# EAGLE schematic test2 (EAGLE 9.5.0)
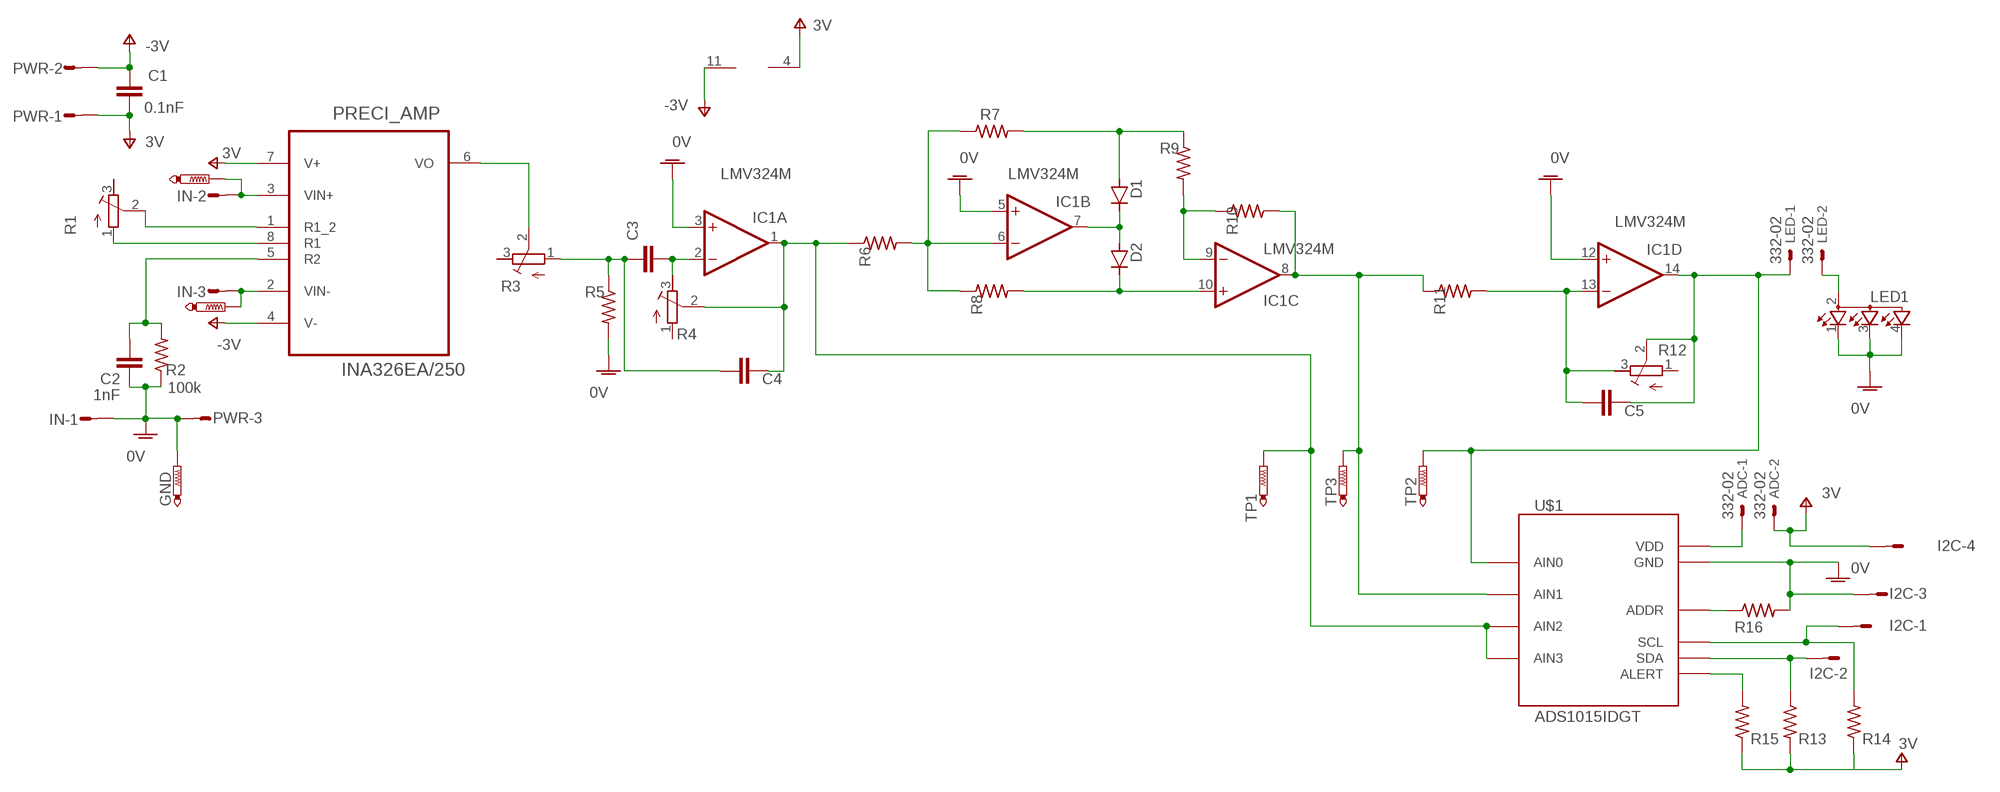
[diagram p0: schematic, sheet 1]

## Parts
ADC  332-02  [332-02]
C1  0.1nF  C-EUC0603  [C0603]
C2  1nF  C-EUC0603  [C0603]
C3  0.1nF  C-EUC0603  [C0603]
C4  0.1nF  C-EUC0603  [C0603]
C5  0.1nF  C-EUC0603  [C0603]
D1  D-SOD-80  [SOD80]
D2  D-SOD-80  [SOD80]
GND  PTR1PAD1-13  [P1-13]
I2C  MT6-4Y  [MT6-4Y]
IC1  LMV324M  [SO14]
IN  MT6-3  [MT6-3]
IN+  PTR1PAD1-13  [P1-13]
IN-  PTR1PAD1-13  [P1-13]
LED  332-02  [332-02]
LED1  TOPLED-3  [P-LCC-4-3]
PRECI_AMP  INA326EA/250  [SOP65P490X110-8N]
PWR  MT6-3  [MT6-3]
R1  R-TRIMM4G/J  [RTRIM4G/J]
R2  100k  R-US_R0603  [R0603]
R3  R-TRIMM4G/J  [RTRIM4G/J]
R4  R-TRIMM4G/J  [RTRIM4G/J]
R5  100k  R-US_R0603  [R0603]
R6  100k  R-US_R0603  [R0603]
R7  100k  R-US_R0603  [R0603]
R8  100k  R-US_R0603  [R0603]
R9  100k  R-US_R0603  [R0603]
R10  100k  R-US_R0603  [R0603]
R11  100k  R-US_R0603  [R0603]
R12  R-TRIMM4G/J  [RTRIM4G/J]
R13  100k  R-US_R0603  [R0603]
R14  100k  R-US_R0603  [R0603]
R15  100k  R-US_R0603  [R0603]
R16  100k  R-US_R0603  [R0603]
TP1  PTR1PAD1-13  [P1-13]
TP2  PTR1PAD1-13  [P1-13]
TP3  PTR1PAD1-13  [P1-13]
U$1  ADS1015IDGT  [MSOP10_0.5]

## Nets
GNDA: C2.1 GND.TP I2C.3 IC1.3(A:+IN) IC1.5(B:+IN) IC1.12(D:+IN) IN.1 LED1.1(CRED) LED1.3(CBLUE) LED1.4(CGREEN) PWR.3 R2.1 R5.2 R16.2 U$1.3(GND) ; supply symbol labelled 0V
N$1: PRECI_AMP.1(R1_2) R1.2(S)
N$2: PRECI_AMP.8(R1) R1.1(A)
N$3: IN+.TP IN.2 PRECI_AMP.3(VIN+)
N$4: C2.2 PRECI_AMP.5(R2) R2.2
N$5: IN-.TP IN.3 PRECI_AMP.2(VIN-)
N$6: C3.2 C4.2 R3.1(A) R5.1
N$7: C3.1 IC1.2(A:-IN) R4.3(E)
N$8: C4.1 IC1.1(A:OUT) R4.2(S) R6.1 TP1.TP U$1.6(AIN2) U$1.7(AIN3)
N$9: PRECI_AMP.6(VO) R3.2(S)
N$10: IC1.6(B:-IN) R6.2 R7.1 R8.1
N$11: D2.1(C) IC1.10(C:+IN) R8.2
N$12: IC1.9(C:-IN) R9.2 R10.1
N$13: D1.1(C) D2.2(A) IC1.7(B:OUT)
N$14: D1.2(A) R7.2 R9.1
N$15: IC1.8(C:OUT) R10.2 R11.1 TP3.TP U$1.5(AIN1)
N$16: C5.2 IC1.13(D:-IN) R11.2 R12.3(E)
N$17: I2C.2 R13.1 U$1.9(SDA)
N$18: R16.1 U$1.1(ADDR)
N$19: R15.2 U$1.2(ALERT)
N$20: LED1.2(A2) LED.2
N$21: I2C.1 R14.2 U$1.10(SCL)
N$22: C5.1 IC1.14(D:OUT) LED.1 R12.2(S) TP2.TP U$1.4(AIN0)
V+: ADC.2 C1.1 I2C.4 IC1.4(P:V+) PRECI_AMP.7(V+) PWR.1 R13.2 R14.1 R15.1 ; supply symbol labelled 3V
V-: C1.2 IC1.11(P:V-) PRECI_AMP.4(V-) PWR.2 ; supply symbol labelled -3V
VDD: ADC.1 U$1.8(VDD)
Unconnected: R1.3(E) R3.3(E) R4.1(A) R12.1(A)

## Library data of the parts
ADC LED = con-garry:332-02: 2 Pin - 2mm Dual Row Source: www.mpe-connector.de / garry_shortform_2012.pdf
C1-C5 = rcl:C-EU: CAPACITOR, European symbol; SPICEPREFIX: C
D1 D2 = semicon-smd-ipc:D-: DIODE unfilled
GND IN+ IN- TP1-TP3 = testpad:PTR1: TEST PIN
I2C = con-amp-mt:MT6-4Y: AMP MT6 CONNECTOR; OC_FARNELL: unknown; OC_NEWARK: unknown
IC1 = linear:LMV324?*: Quad General Purpose, Low Voltage, Rail-to-Rail Output Operational Amplifiers Source: http://www.national.com/mpf/LM/LMV321.html http://www.national.com/dt/lmv_qual.pdf; SPICEPREFIX: J
IN PWR = con-amp-mt6:MT6-3: AMP MT6 CONNECTOR; OC_FARNELL: unknown; OC_NEWARK: unknown
LED1 = led:TOPLED-3: OSRAM - Hyper Multi TOPLED® (RGB) LB E673, LV E673, LT E673 - Power TOPLED® Enhanced optical Power LED (HOP2000) LS E67B, LA E67B, LO E67B, LY E67B - Hyper Multi TOPLED® Enhanced optical Power LED (HOP2000 / ATON®) LATB T66B - Hyper Multi TOPLED® Hyper-Bright LED LATB T686 Source: http://www.osram.convergy.de/
PRECI_AMP = INA326EA_250:INA326EA/250: Precision, Rail-to-Rail I/O INSTRUMENTATION AMPLIFIER; DESCRIPTION: Precision, Low Drift, CMOS Instrumentation Amplifier 8-VSSOP -40 to 85; DIGI-KEY_PART_NUMBER: 296-15312-1-ND; DIGI-KEY_PURCHASE_URL: https://www.digikey.com/product-detail/en/texas-instruments/INA326EA-250/296-15312-1-ND/568254?utm_source=snapeda&utm_medium=aggregator&utm_campaign=symbol; MF: Texas Instruments; MP: INA326EA/250; PACKAGE: MSOP-8 Texas Instruments
R1 R3 R4 R12 = trimmer:R-TRIMM: Trimm resistor; SPICEMODEL: X; SPICEPREFIXL: POT
R2 R5-R11 R13-R16 = rcl:R-US_: RESISTOR, American symbol; SPICEPREFIX: R
U$1 = ADS1015:ADS1015: Ti ADS1015 12-bit ADC Ultra-Small, Low-Power, 12-Bit Analog-to-Digital Converter with Internal Reference The ADS1013, ADS1014, and ADS1015 are precision analog-to-digital converters (ADCs) with 12 bits of resolution offered in an ultra-small, leadless QFN-10 package or an MSOP-10 package. \ Source: http://focus.ti.com/docs/prod/folders/print/ads1015.html; AVAILABILITY: Unavailable; DESCRIPTION: 12-Bit ADC with Integrated MUX PGA Comparator Oscillator and Reference; MF: Texas Instruments; MP: ADS1015; PACKAGE: XFQFN-10 Texas Instruments; PRICE: None